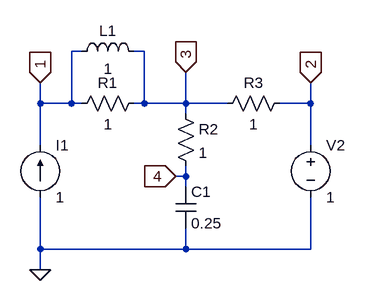
[diagram p0: schematic Two port circuit6.asc]
Two port circuit6.asc, the LTspice schematic file:
Version 4
SHEET 1 880 680
WIRE 32 0 16 0
WIRE 128 0 112 0
WIRE -32 80 -32 48
WIRE 16 80 16 0
WIRE 16 80 -32 80
WIRE 32 80 16 80
WIRE 128 80 128 0
WIRE 128 80 112 80
WIRE 192 80 192 32
WIRE 192 80 128 80
WIRE 256 80 192 80
WIRE 384 80 384 48
WIRE 384 80 336 80
WIRE 192 96 192 80
WIRE -32 144 -32 80
WIRE 384 144 384 80
WIRE 192 192 192 176
WIRE 192 192 176 192
WIRE 192 208 192 192
WIRE -32 304 -32 224
WIRE 192 304 192 272
WIRE 192 304 -32 304
WIRE 384 304 384 224
WIRE 384 304 192 304
WIRE -32 336 -32 304
FLAG -32 336 0
FLAG 192 32 3
IOPIN 192 32 In
FLAG -32 48 1
IOPIN -32 48 In
FLAG 384 48 2
IOPIN 384 48 In
FLAG 176 192 4
IOPIN 176 192 In
SYMBOL voltage 384 128 R0
WINDOW 123 0 0 Left 2
WINDOW 39 0 0 Left 2
SYMATTR InstName V2
SYMATTR Value 1
SYMBOL current -32 224 M180
WINDOW 0 24 80 Left 2
WINDOW 3 24 0 Left 2
WINDOW 123 0 0 Left 2
WINDOW 39 0 0 Left 2
SYMATTR InstName I1
SYMATTR Value 1
SYMBOL res 16 96 R270
WINDOW 0 32 56 VTop 2
WINDOW 3 0 56 VBottom 2
SYMATTR InstName R1
SYMATTR Value 1
SYMBOL res 240 96 R270
WINDOW 0 32 56 VTop 2
WINDOW 3 0 56 VBottom 2
SYMATTR InstName R3
SYMATTR Value 1
SYMBOL cap 176 208 R0
SYMATTR InstName C1
SYMATTR Value 0.25
SYMBOL ind 16 16 R270
WINDOW 0 32 56 VTop 2
WINDOW 3 5 56 VBottom 2
SYMATTR InstName L1
SYMATTR Value 1
SYMBOL res 176 80 R0
SYMATTR InstName R2
SYMATTR Value 1

The netlist it stands for:
* Two port circuit6.asc
V2 2 0 1
I1 0 1 1
R1 1 3 1
R3 3 2 1
C1 4 0 0.25
L1 1 3 1
R2 3 4 1
.backanno
.end